# Altium project MSXIV_Rear_Power_Distribution.PrjPcb (part 1 of 5)
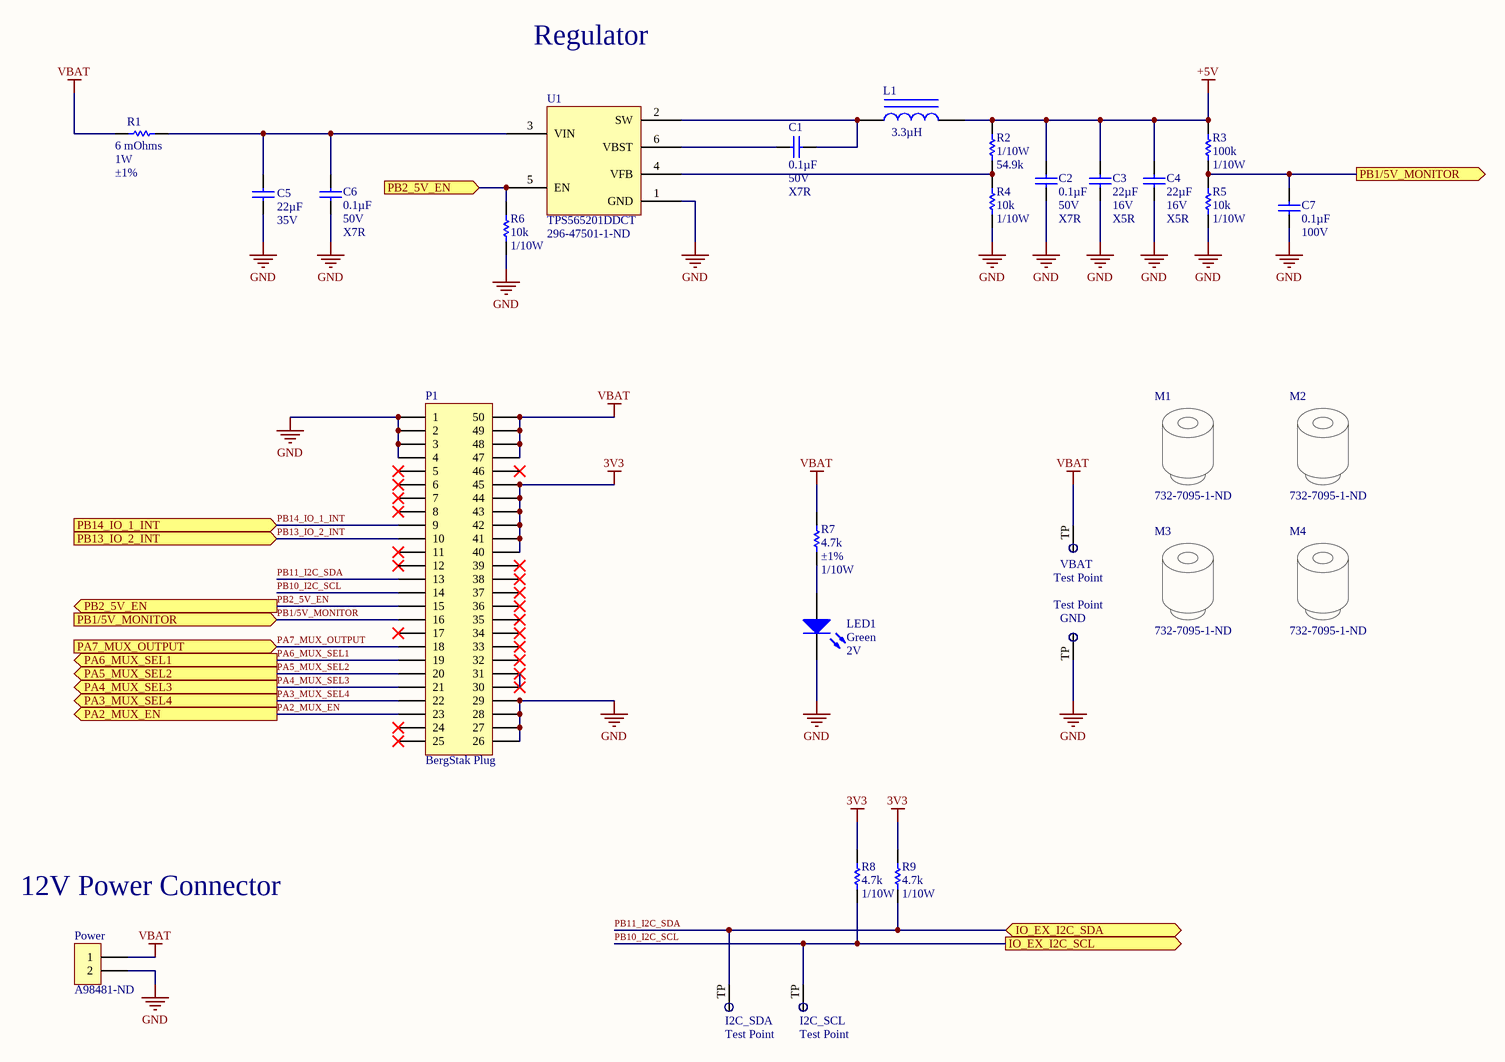
[diagram p0: Controller_Board_Interface.SchDoc]
9 sheets, 277 parts. Net scope: flat (ports and power ports of the same name join across sheets).
Board file: Rear Power Distribution.PcbDoc
Sheets:
  Controller_Board_Interface.SchDoc
  Power Distribution - IO Expander.SchDoc
  Power Distribution - Strobe and Center Brake Lights.SchDoc
  Power Distribution - Spares 8-9 5V.SchDoc
  Power Distribution - Motor Interface.SchDoc
  Power Distribution - Spares 1-4 5V.SchDoc
  Power Distribution - Rear Turn and Brake Lights.SchDoc
  Power Distribution - Solar Sense, Telemetry, and BMS.SchDoc
  Power Distribution -  Rear Camera and Charger.SchDoc

## Sheet Controller_Board_Interface.SchDoc: Controller Board Interface
size B; Organization: Midnight Sun Solar Rayce Car Team; Address1: University of Waterloo; Address2: 200 University Ave W; Address3: Waterloo, ON, Canada; Address4: N2L 3E9; Website: www.uwmidsun.com; ProjectName: ProjectName

### Parts
C1  Capacitance: 0.1µF  Voltage: 50V  Temperature Coefficient: X7R  [CAP, 0603]  (hidden comment: CAP CER 0.1UF 50V 10% X7R 0603)
C2  Capacitance: 0.1µF  Voltage: 50V  Temperature Coefficient: X7R  [CAP, 0603]  (hidden comment: CAP CER 0.1UF 50V 10% X7R 0603)
C3  Capacitance: 22µF  Voltage: 16V  Temperature Coefficient: X5R  [CAP, 1210]  (hidden comment: CAP CER 22UF 16V ±20% X5R 1210)
C4  Capacitance: 22µF  Voltage: 16V  Temperature Coefficient: X5R  [CAP, 1210]  (hidden comment: CAP CER 22UF 16V ±20% X5R 1210)
C5  CAP CER 22UF 35V X5R 0805  [CAP, 0805]  (value not drawn)
C6  Capacitance: 0.1µF  Voltage: 50V  Temperature Coefficient: X7R  [CAP, 0603]  (hidden comment: CAP CER 0.1UF 50V 10% X7R 0603)
C7  Capacitance: 0.1µF  Voltage: 100V  [CAP, 0805]  (hidden comment: CAP CER 0.1UF 100V 10% X7R 0805)
GND  Test Point  [Test Point]  (no BOM)
I2C_SCL  Test Point  [Test Point]  (no BOM)
I2C_SDA  Test Point  [Test Point]  (no BOM)
L1  Inductance: 3.3µH  [IND_1264EY-3R3N=P3]  (hidden comment: FIXED IND 3.3UH 6.5A 25.2 MOHM)
LED1  Color: Green  Voltage - Forward (Vf) (Typ): 2V  [LED_0603]  (hidden comment: LED GREEN CLEAR 2V 0603)
M1  Supplier Part Number 1: 732-7095-1-ND  [M2.5 Standoff]  (hidden comment: STANDOFF RND M2.5X0.45 STEEL 5MM)
M2  Supplier Part Number 1: 732-7095-1-ND  [M2.5 Standoff]  (hidden comment: STANDOFF RND M2.5X0.45 STEEL 5MM)
M3  Supplier Part Number 1: 732-7095-1-ND  [M2.5 Standoff]  (hidden comment: STANDOFF RND M2.5X0.45 STEEL 5MM)
M4  Supplier Part Number 1: 732-7095-1-ND  [M2.5 Standoff]  (hidden comment: STANDOFF RND M2.5X0.45 STEEL 5MM)
P1  Series: BergStak Plug  [CONN, Bergstak 50 Pos Plug]  (hidden comment: CONN 50POS Bergstak Plug 0.02")
Power  Supplier Part Number 1: A98481-ND  [6PCV-02-006]  (hidden comment: CONN BARRIER STRIP 2CIRC 0.375")
R1  Resistance: 6 mOhms  Power (Watts): 1W  Tolerance: ±1%  [RES 1206]  (hidden comment: RES 0.006 OHM 1% 1W 1206)
R2  Power (Watts): 1/10W  Resistance (Ohms): 54.9k  [RES, 0603]  (hidden comment: RES 54.9K OHM 1% 1/10W 0603)
R3  Resistance: 100k  Power: 1/10W  [RES, 0603]  (hidden comment: RES 100K OHM 5% 1/8W 0603)
R4  Resistance: 10k  Power: 1/10W  [RES, 0603]  (hidden comment: RES 10K OHM 1% 1/10W 0603)
R5  Resistance: 10k  Power: 1/10W  [RES, 0603]  (hidden comment: RES 10K OHM 1% 1/10W 0603)
R6  Resistance: 10k  Power: 1/10W  [RES, 0603]  (hidden comment: RES 10K OHM 1% 1/10W 0603)
R7  Resistance (Ohms): 4.7k  Tolerance: ±1%  Power (Watts): 1/10W  [RES, 0603]  (hidden comment: RES 4.7K OHM 1% 1/10W 0603)
R8  Resistance (Ohms): 4.7k  Power (Watts): 1/10W  [RES, 0603]  (hidden comment: RES 4.7K OHM 1% 1/10W 0603)
R9  Resistance (Ohms): 4.7k  Power (Watts): 1/10W  [RES, 0603]  (hidden comment: RES 4.7K OHM 1% 1/10W 0603)
U1  Manufacturer Part Number: TPS565201DDCT  Supplier Part Number 1: 296-47501-1-ND  [IC REG BUCK 4.5V TO 17V, 5A]  (hidden comment: IC REG BUCK 4.5V TO 17V, 5A, SYNCHRONOUS STE)
VBAT  Test Point  [Test Point]  (no BOM)

### Ports
IO_EX_I2C_SCL (out), IO_EX_I2C_SDA (bidir), PA2_MUX_EN (out), PA3_MUX_SEL4 (out), PA4_MUX_SEL3 (out), PA5_MUX_SEL2 (out), PA6_MUX_SEL1 (out), PA7_MUX_OUTPUT (in), PB1/5V_MONITOR (in), PB1/5V_MONITOR (out), PB2_5V_EN (in), PB2_5V_EN (out), PB13_IO_2_INT (in), PB14_IO_1_INT (in)

### Nets
3V3: P1.40 P1.41 P1.42 P1.43 P1.44 P1.45 R8.1 R9.1
+5V: C2.1 C3.1 C4.1 L1.2 R2.1 R3.1
GND: C2.2 C3.2 C4.2 C5.2 C6.2 C7.2 GND.TP LED1.2(K) P1.1 P1.2 P1.3 P1.4 P1.26 P1.27 P1.28 P1.29 Power.2 R4.2 R5.2 R6.2 U1.1(GND)
VBAT: P1.47 P1.48 P1.49 P1.50 Power.1 R1.1 R7.1 VBAT.TP
PA2_MUX_EN: P1.23 ; port PA2_MUX_EN
PA3_MUX_SEL4: P1.22 ; port PA3_MUX_SEL4
PA4_MUX_SEL3: P1.21 ; port PA4_MUX_SEL3
PA5_MUX_SEL2: P1.20 ; port PA5_MUX_SEL2
PA6_MUX_SEL1: P1.19 ; port PA6_MUX_SEL1
PA7_MUX_OUTPUT: P1.18 ; port PA7_MUX_OUTPUT
PB1/5V_MONITOR: C7.1 P1.16 R3.2 R5.1 ; port PB1/5V_MONITOR
PB2_5V_EN: P1.15 R6.1 U1.5(EN) ; port PB2_5V_EN
PB10_I2C_SCL: I2C_SCL.TP P1.14 R8.2 ; port IO_EX_I2C_SCL  [project net IO_EX_I2C_SCL]
PB11_I2C_SDA: I2C_SDA.TP P1.13 R9.2 ; port IO_EX_I2C_SDA  [project net IO_EX_I2C_SDA]
PB13_IO_2_INT: P1.10 ; port PB13_IO_2_INT
PB14_IO_1_INT: P1.9 ; port PB14_IO_1_INT
NetC1_1: C1.1 U1.6(VBST)
NetC1_2: C1.2 L1.1 U1.2(SW)
NetC5_1: C5.1 C6.1 R1.2 U1.3(VIN)
NetLED1_1: LED1.1(A) R7.2
NetP1_30: P1.30 P1.31
NetR2_2: R2.2 R4.1 U1.4(VFB)

Not connected (* = marked no-connect by the designer): P1 5* 6* 7* 8* 11* 12* 17* 24* 25* 32* 33* 34* 35* 36* 37* 38* 39* 46*

### Notes on the sheet
- Regulator
- 12V Power Connector
- PROJECT
- DOCUMENT
- DRAWN BY
- LAST MODIFIED
- PART NUMBER
- REVISION
- SHEET
- VARIANT
- OF
- Engineering 5 - 1002
  University of Waterloo
  (519) 888-4567 x32978
  hardware@uwmidsun.com
- (in symbol CAP CER 22UF 35V X5R 0805) 22µF

### Library data of the parts
C1 C2 C6 = CAP CER 0.1UF 50V 10% X7R 0603: 0.10µF ±10% 50V Ceramic Capacitor X7R 0603 (1608 Metric); Manufacturer 1: AVX Corporation; Manufacturer Part Number 1: 06035C104KAT2A; Supplier 1: Digi-Key; Supplier Part Number 1: 478-5052-1-ND; Packaging: Cut Tape (CT); Part Status: Active; Operating Temperature: -55°C ~ 125°C; Ratings: -; Mounting Type: Surface Mount, MLCC; Package / Case: 0603 (1608 Metric); Size / Dimension: 0.063" L x 0.032" W (1.60mm x 0.81mm); Height - Seated (Max): -; Thickness (Max): 0.035" (0.90mm); Lead Spacing: -; Lead Style: -; ComponentLink1URL: http://datasheets.avx.com/X7RDielectric.pdf; ComponentLink1Description: http://datasheets.avx.com/X7RDielectric.pdf; Tolerance: ±10%
C3 C4 = CAP CER 22UF 16V ±20% X5R 1210: 22µF ±20% 16V Ceramic Capacitor X5R 1210 (3225 Metric); Manufacturer 1: Murata Electronics North America; Manufacturer Part Number 1: GRM32ER61C226ME20L; Supplier 1: Digi-Key; Supplier Part Number 1: 490-1881-1-ND; Packaging: Cut Tape (CT); Part Status: Active; Operating Temperature: -55°C ~ 85°C; Ratings: -; Mounting Type: Surface Mount, MLCC; Package / Case: 1210 (3225 Metric); Size / Dimension: 0.126" L x 0.098" W (3.20mm x 2.50mm); Height - Seated (Max): -; Thickness (Max): 0.106" (2.70mm); Lead Spacing: -; Lead Style: -; ComponentLink1URL: http://www.murata.com/~/media/webrenewal/support/library/catalog/products/capacitor/mlcc/c02e.ashx; ComponentLink1Description: http://www.murata.com/~/media/webrenewal/support/library/catalog/products/capacitor/mlcc/c02e.ashx; Tolerance: ±20%
C5 = CAP CER 22UF 35V X5R 0805: 22µF ±20% 35V Ceramic Capacitor X5R 0805 (2012 Metric); Manufacturer: TDK; Manufacturer Part Number: C2012X5R1V226M125AC; Supplier 1: Digi-Key; RoHS: Yes; Stock 1: 30; Pricing 1: 1 = 1.29000, 10 = 0.98100, 100 = 0.70190, 500 = 0.54338, 1000 = 0.46791 (USD); Mount: Surface Mount; Case/Package: 0805; Weight: 0.000194oz; Case Code (Metric): 2012; Case Code (Imperial): 0805; Dielectric Material: Ceramic; Min Operating Temperature: -55°C; Max Operating Temperature: 85°C; Package Quantity: 2000; Packaging: Tape and Reel; Capacitance: 22uF; Tolerance: 20%; Voltage Rating: 35V; Dielectric: X5R; Termination: SMD/SMT; Voltage Rating (DC): 35V; Length: 0.079inch; Height: 1.25mm; Width: 0.049inch; Thickness: 0.057inch; REACH SVHC: No SVHC; Lead Free: Lead Free; ComponentLink1URL: https://product.tdk.com/info/en/catalog/spec/mlccspec_commercial_general_midvoltage_en.pdf; ComponentLink1Description: https://product.tdk.com/info/en/catalog/spec/mlccspec_commercial_general_midvoltage_en.pdf; Supplier Part Number 1: 445-14428-1-ND
C7 = CAP CER 0.1UF 100V 10% X7R 0805: 0.1µF ±10% 100V Ceramic Capacitor X7R 0805 (2012 Metric); Manufacturer 1: Murata Electronics North America; Manufacturer Part Number 1: GCM21BR72A104KA37L; Supplier 1: Digi-Key; Supplier Part Number 1: 490-4789-1-ND; Packaging: Cut Tape (CT); Part Status: Active; Operating Temperature: -55°C ~ 125°C; Ratings: AEC-Q200; Mounting Type: Surface Mount, MLCC; Package / Case: 0805 (2012 Metric); Size / Dimension: 0.079" L x 0.049" W (2.00mm x 1.25mm); Height - Seated (Max): -; Thickness (Max): 0.055" (1.40mm); Lead Spacing: -; Lead Style: -; ComponentLink1URL: http://www.murata.com/~/media/webrenewal/support/library/catalog/products/capacitor/mlcc/c03e.ashx; ComponentLink1Description: http://www.murata.com/~/media/webrenewal/support/library/catalog/products/capacitor/mlcc/c03e.ashx; Tolerance: ±10%; Temperature Coefficient: X7R
L1 = FIXED IND 3.3UH 6.5A 25.2 MOHM: 3.3µH Shielded Wirewound Inductor 6.5A 25.2mOhm Max Nonstandard; Tolerance: ±30%; Inductance Frequency - Test: 100kHz; Material - Core: Ferrite; Supplier 1: Digi-Key; ComponentLink1Description: https://search.murata.co.jp/Ceramy/image/img/P02/J(E)TE243B-0044_DG6050C_reference.pdf; ComponentLink1URL: https://search.murata.co.jp/Ceramy/image/img/P02/J(E)TE243B-0044_DG6050C_reference.pdf; Type: Wirewound; Current Rating (Amps): 6.5A; Shielding: Shielded; DC Resistance (DCR): 25.2mOhm Max; Supplier Part Number 1: 490-10821-1-ND
LED1 = LED GREEN CLEAR 2V 0603: Green 572nm LED Indication - Discrete 2V 0603 (1608 Metric); Manufacturer: Wurth Electronics Inc.; Manufacturer Part Number: 150060VS75000; Lens Color: Colorless; Millicandela Rating: 40mcd; Lens Style/Size: Rectangle with Flat Top, 1.10mm x 0.70mm; Current - Test: 20mA; Viewing Angle: 140°; Wavelength - Dominant: 570nm; Supplier 1: Digi-Key; Supplier Part Number 1: 732-4980-1-ND; Packaging: Cut Tape (CT); Part Status: Active; Lens Transparency: Clear; Mounting Type: Surface Mount; Wavelength - Peak: 572nm; Package / Case: 0603 (1608 Metric); Supplier Device Package: 0603; Size / Dimension: 1.60mm L x 0.80mm W; Height (Max): 0.80mm; ComponentLink1URL: http://katalog.we-online.de/led/datasheet/150060VS75000.pdf; ComponentLink1Description: http://katalog.we-online.de/led/datasheet/150060VS75000.pdf; Category: Optoelectronics; Features: -; Pricing 1: 1=0.21, 100=0.1617, 500=0.13964 (CAD); RoHS: RoHS Compliant; Stock 1: 9408
M1-M4 = STANDOFF RND M2.5X0.45 STEEL 5MM: Manufacturer: Wurth Electronics; Manufacturer Part Number: 9774050151R; Plating: Tin; Threaded/Unthreaded: Threaded; Outside Diameter: 0.201inch; Supplier 1: Digi-Key; RoHS: Yes; Stock 1: 24846; Pricing 1: 1 = 1.09000, 10 = 1.03000, 50 = 0.91800, 100 = 0.84000 (USD); Material: Steel; Length: 0.252inch; REACH SVHC: Unknown
P1 = CONN 50POS Bergstak Plug 0.02": 50 Position Connector Plug, Outer Shroud Contacts Surface Mount Gold; Manufacturer 1: Amphenol FCI; Manufacturer Part Number 1: 10132797-055100LF; Number of Positions: 50; Mated Stacking Heights: 5mm; Pitch: 0.020" (0.50mm); Supplier 1: Digi-Key; Supplier Part Number 1: 609-5226-1-ND; Packaging: Cut Tape (CT); Part Status: Active; Connector Type: Plug, Outer Shroud Contacts; Number of Rows: 2; Mounting Type: Surface Mount; Contact Finish: Gold; Contact Finish Thickness: 1µin (0.025µm); Height Above Board: 0.169" (4.30mm); ComponentLink1URL: http://portal.fciconnect.com/Comergent//fci/drawing/10132797.pdf; ComponentLink1Description: http://portal.fciconnect.com/Comergent//fci/drawing/10132797.pdf
Power = CONN BARRIER STRIP 2CIRC 0.375": 2 Circuit 0.375" (9.53mm) Barrier Block Connector, Screws; ComponentLink1Description: https://www.te.com/commerce/DocumentDelivery/DDEController?Action=srchrtrv&DocNm=3-1437652-9&DocType=Customer+Drawing&DocLang=English; ComponentLink1URL: https://www.te.com/commerce/DocumentDelivery/DDEController?Action=srchrtrv&DocNm=3-1437652-9&DocType=Customer+Drawing&DocLang=English; Supplier 1: Digi-Key
R1 = RES 0.006 OHM 1% 1W 1206: 6 mOhms ±1% 1W Chip Resistor 1206 (3216 Metric) Automotive AEC-Q200, Current Sense Thick Film; ComponentLink1Description: https://d1d2qsbl8m0m72.cloudfront.net/en/products/databook/datasheet/passive/resistor/chip_resistor/pmr-e.pdf; ComponentLink1URL: https://d1d2qsbl8m0m72.cloudfront.net/en/products/databook/datasheet/passive/resistor/chip_resistor/pmr-e.pdf; Supplier 1: Digi-Key; Composition: Thick Film; Supplier Device Package: 1206; Ratings: AEC-Q200; Operating Temperature: -55°C ~ 155°C; Packaging: Cut Tape (CT); Series: PMR; Supplier Part Number 1: RHM.006ALCT-ND
R2 = RES 54.9K OHM 1% 1/10W 0603: 54.9k Ohm ±1% 0.1W, 1/10W Chip Resistor 0603 (1608 Metric) Automotive AEC-Q200 Thick Film; Manufacturer: Panasonic Electronic Components; Manufacturer Part Number: ERJ-3EKF5492V; Temperature Coefficient: ±100ppm/°C; Supplier 1: Digi-Key; RoHS: RoHS Compliant; Category: Resistors; Stock 1: 74038; Pricing 1: 1=0.16, 10=0.031, 100=0.0127, 1000=0.00567, 2500=0.00492 (CAD); Packaging: Cut Tape (CT); Part Status: Active; Composition: Thick Film; Features: Automotive AEC-Q200; Operating Temperature: -55°C ~ 155°C; Package / Case: 0603 (1608 Metric); Supplier Device Package: 0603; Size / Dimension: 0.063" L x 0.031" W (1.60mm x 0.80mm); Height - Seated (Max): 0.022" (0.55mm); Failure Rate: -; ComponentLink1URL: https://industrial.panasonic.com/cdbs/www-data/pdf/RDA0000/AOA0000C298.pdf; ComponentLink1Description: https://industrial.panasonic.com/cdbs/www-data/pdf/RDA0000/AOA0000C298.pdf; Supplier Part Number 1: P54.9KHCT-ND; Tolerance: ±1%
R3 = RES 100K OHM 5% 1/8W 0603: RES SMD 100K OHM 5% 1/10W 0603; Manufacturer 1: Yageo; Manufacturer Part Number 1: RC0603JR-07100KL; Temperature Coefficient: ±100ppm/°C; Supplier 1: Digi-Key; Supplier Part Number 1: 311-100KGRCT-ND; Packaging: Cut Tape (CT); Part Status: Active; Composition: Thick Film; Operating Temperature: -55°C ~ 155°C; Package / Case: 0603 (1608 Metric); Supplier Device Package: 0603; Size / Dimension: 0.063" L x 0.031" W (1.60mm x 0.80mm); Height - Seated (Max): 0.022" (0.55mm); Failure Rate: -; ComponentLink1URL: http://www.yageo.com/documents/recent/PYu-RC_Group_51_RoHS_L_7.pdf; ComponentLink1Description: http://www.yageo.com/documents/recent/PYu-RC_Group_51_RoHS_L_7.pdf; Tolerance: ±5%
R4-R6 = RES 10K OHM 1% 1/10W 0603: RES SMD 10K OHM 1% 1/10W 0603; Manufacturer 1: Yageo; Manufacturer Part Number 1: RC0603FR-0710KL; Temperature Coefficient: ±100ppm/°C; Supplier 1: Digi-Key; Supplier Part Number 1: 311-10.0KHRCT-ND; Packaging: Cut Tape (CT); Part Status: Active; Composition: Thick Film; Operating Temperature: -55°C ~ 155°C; Package / Case: 0603 (1608 Metric); Supplier Device Package: 0603; Size / Dimension: 0.063" L x 0.031" W (1.60mm x 0.80mm); Height - Seated (Max): 0.022" (0.55mm); Failure Rate: -; ComponentLink1URL: http://www.yageo.com/documents/recent/PYu-RC_Group_51_RoHS_L_7.pdf; ComponentLink1Description: http://www.yageo.com/documents/recent/PYu-RC_Group_51_RoHS_L_7.pdf; Tolerance: ±1%
R7-R9 = RES 4.7K OHM 1% 1/10W 0603: 4.7k Ohm ±1% 0.1W, 1/10W Chip Resistor 0603 (1608 Metric) Moisture Resistant Thick Film; Manufacturer 1: Yageo; Manufacturer Part Number 1: RC0603FR-074K7L; Description 1: RES SMD 4.7K OHM 1% 1/10W 0603; Temperature Coefficient: ±100ppm/°C; Supplier 1: Digi-Key; Supplier Part Number 1: 311-4.70KHRCT-ND; RoHS: RoHS Compliant; Category: Resistors; Stock 1: 3487566; Pricing 1: 1=0.16, 10=0.022, 100=0.0089, 1000=0.00402, 2500=0.00349 (CAD); Packaging: Cut Tape (CT); Part Status: Active; Composition: Thick Film; Features: Moisture Resistant; Operating Temperature: -55°C ~ 155°C; Package / Case: 0603 (1608 Metric); Supplier Device Package: 0603; Size / Dimension: 0.063" L x 0.031" W (1.60mm x 0.80mm); Height - Seated (Max): 0.022" (0.55mm); Failure Rate: -; ComponentLink1URL: http://www.yageo.com/documents/recent/PYu-RC_Group_51_RoHS_L_7.pdf; ComponentLink1Description: http://www.yageo.com/documents/recent/PYu-RC_Group_51_RoHS_L_7.pdf
  R8 R9: Tolerance: ±1%
U1 = IC REG BUCK 4.5V TO 17V, 5A, SYNCHRONOUS STE: Buck Switching Regulator IC Positive Adjustable 0.6V 1 Output 5A SOT-23-6 Thin, TSOT-23-6; Manufacturer: Texas Instruments; Supplier 1: Digi-Key; Stock 1: 2226; Pricing 1: 1 = 2.46000, 10 = 2.21100, 100 = 1.77710 (USD); Min Operating Temperature: -40°C; Max Operating Temperature: 125°C

## Sheet Power Distribution - IO Expander.SchDoc: Title
size B; Organization: Midnight Sun Solar Rayce Car Team; Address1: University of Waterloo; Address2: 200 University Ave W; Address3: Waterloo, ON, Canada; Address4: N2L 3E9; Website: www.uwmidsun.com; ProjectName: ProjectName
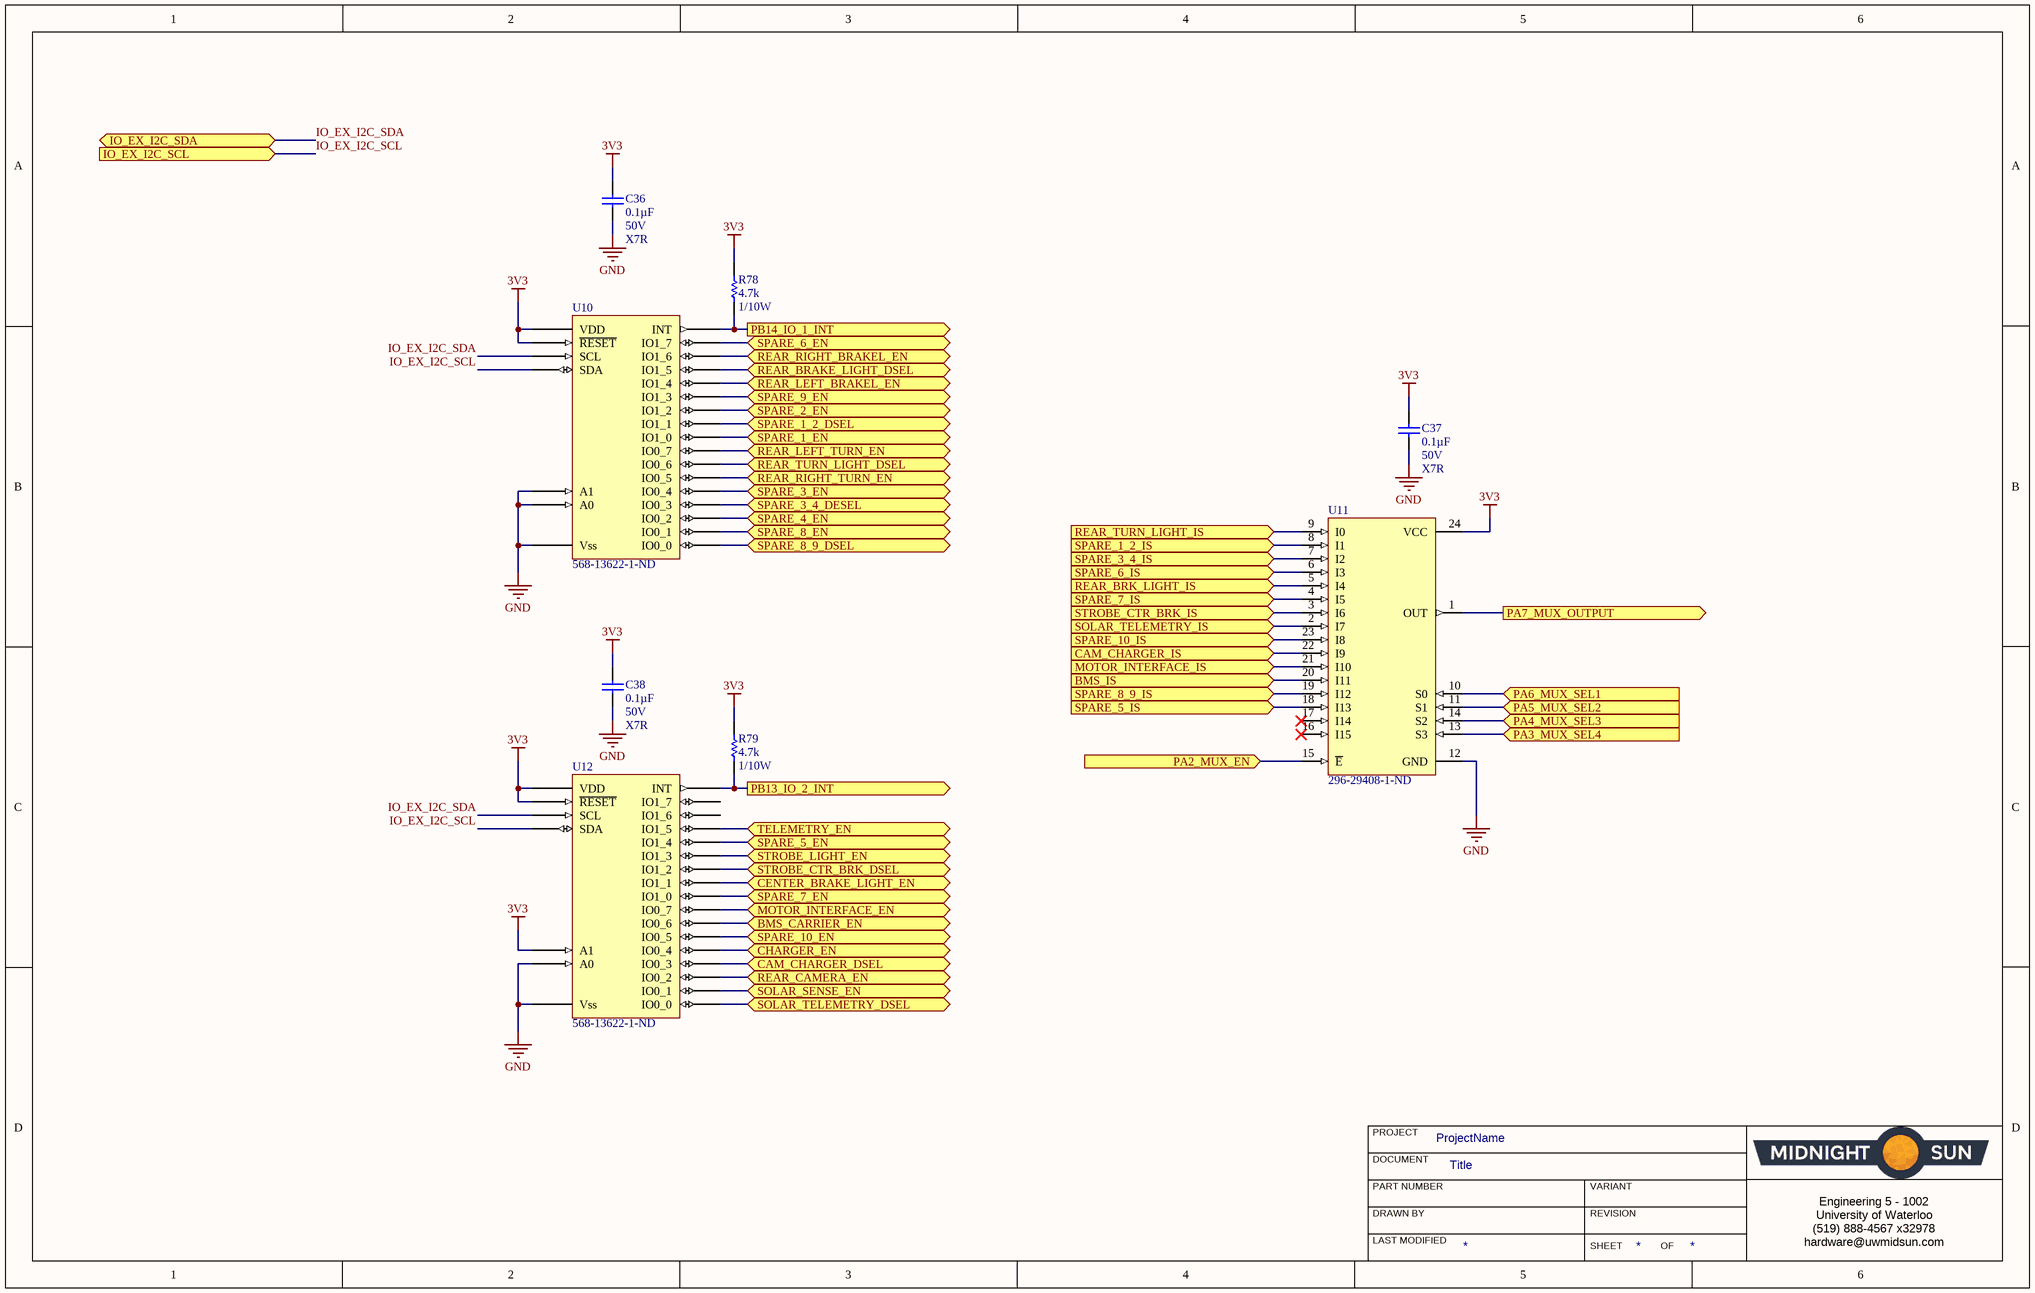
[diagram p1: Power Distribution - IO Expander.SchDoc]

### Parts
C36  Capacitance: 0.1µF  Voltage: 50V  Temperature Coefficient: X7R  [CAP, 0603]  (hidden comment: CAP CER 0.1UF 50V 10% X7R 0603)
C37  Capacitance: 0.1µF  Voltage: 50V  Temperature Coefficient: X7R  [CAP, 0603]  (hidden comment: CAP CER 0.1UF 50V 10% X7R 0603)
C38  Capacitance: 0.1µF  Voltage: 50V  Temperature Coefficient: X7R  [CAP, 0603]  (hidden comment: CAP CER 0.1UF 50V 10% X7R 0603)
R78  Resistance (Ohms): 4.7k  Power (Watts): 1/10W  [RES, 0603]  (hidden comment: RES 4.7K OHM 1% 1/10W 0603)
R79  Resistance (Ohms): 4.7k  Power (Watts): 1/10W  [RES, 0603]  (hidden comment: RES 4.7K OHM 1% 1/10W 0603)
U10  Supplier Part Number 1: 568-13622-1-ND  [SOP127P600-8N]  (hidden comment: 16-BIT I2C-BUS AND SMBUS LOW POW)
U11  Supplier Part Number 1: 296-29408-1-ND  [SOP127P1030X265-24N]  (hidden comment: IC MUX/DEMUX 1X16 24SSOP)
U12  Supplier Part Number 1: 568-13622-1-ND  [SOP127P600-8N]  (hidden comment: 16-BIT I2C-BUS AND SMBUS LOW POW)

### Ports
BMS_CARRIER_EN (bidir), BMS_IS (in), CAM_CHARGER_DSEL (bidir), CAM_CHARGER_IS (in), CENTER_BRAKE_LIGHT_EN (bidir), CHARGER_EN (bidir), IO_EX_I2C_SCL (in), IO_EX_I2C_SDA (bidir), MOTOR_INTERFACE_EN (bidir), MOTOR_INTERFACE_IS (in), PA2_MUX_EN (in), PA3_MUX_SEL4 (in), PA4_MUX_SEL3 (in), PA5_MUX_SEL2 (in), PA6_MUX_SEL1 (in), PA7_MUX_OUTPUT (out), PB13_IO_2_INT (out), PB14_IO_1_INT (out), REAR_BRAKE_LIGHT_DSEL (bidir), REAR_BRK_LIGHT_IS (in), REAR_CAMERA_EN (bidir), REAR_LEFT_BRAKEL_EN (bidir), REAR_LEFT_TURN_EN (bidir), REAR_RIGHT_BRAKEL_EN (bidir), REAR_RIGHT_TURN_EN (bidir), REAR_TURN_LIGHT_DSEL (bidir), REAR_TURN_LIGHT_IS (in), SOLAR_SENSE_EN (bidir), SOLAR_TELEMETRY_DSEL (bidir), SOLAR_TELEMETRY_IS (in), SPARE_1_2_DSEL (bidir), SPARE_1_2_IS (in), SPARE_1_EN (bidir), SPARE_2_EN (bidir), SPARE_3_4_DESEL (bidir), SPARE_3_4_IS (in), SPARE_3_EN (bidir), SPARE_4_EN (bidir), SPARE_5_EN (bidir), SPARE_5_IS (in), SPARE_6_EN (bidir), SPARE_6_IS (in), SPARE_7_EN (bidir), SPARE_7_IS (in), SPARE_8_9_DSEL (bidir), SPARE_8_9_IS (in), SPARE_8_EN (bidir), SPARE_9_EN (bidir), SPARE_10_EN (bidir), SPARE_10_IS (in), STROBE_CTR_BRK_DSEL (bidir), STROBE_CTR_BRK_IS (in), STROBE_LIGHT_EN (bidir), TELEMETRY_EN (bidir)

### Nets
3V3: C36.1 C37.1 C38.1 R78.1 R79.1 U10.3(~{RESET}) U10.24(VDD) U11.24(VCC) U12.2(A1) U12.3(~{RESET}) U12.24(VDD)
GND: C36.2 C37.2 C38.2 U10.2(A1) U10.12(Vss) U10.21(A0) U11.12(GND) U12.12(Vss) U12.21(A0)
IO_EX_I2C_SCL: U10.23(SDA) U12.23(SDA) ; port IO_EX_I2C_SCL
IO_EX_I2C_SDA: U10.22(SCL) U12.22(SCL) ; port IO_EX_I2C_SDA
PA2_MUX_EN: U11.15(~{E}) ; port PA2_MUX_EN
PA3_MUX_SEL4: U11.13(S3) ; port PA3_MUX_SEL4
PA4_MUX_SEL3: U11.14(S2) ; port PA4_MUX_SEL3
PA5_MUX_SEL2: U11.11(S1) ; port PA5_MUX_SEL2
PA6_MUX_SEL1: U11.10(S0) ; port PA6_MUX_SEL1
PA7_MUX_OUTPUT: U11.1(OUT) ; port PA7_MUX_OUTPUT
PB13_IO_2_INT: R79.2 U12.1(INT) ; port PB13_IO_2_INT
PB14_IO_1_INT: R78.2 U10.1(INT) ; port PB14_IO_1_INT
NetC9_1: U11.22(I9) ; port CAM_CHARGER_IS
NetC14_1: U11.23(I8) ; port SPARE_10_IS
NetC19_1: U11.6(I3) ; port SPARE_6_IS
NetC22_1: U11.3(I6) ; port STROBE_CTR_BRK_IS
NetC24_1: U11.4(I5) ; port SPARE_7_IS
NetC30_1: U11.18(I13) ; port SPARE_5_IS
NetC31_1: U11.9(I0) ; port REAR_TURN_LIGHT_IS
NetC35_1: U11.5(I4) ; port REAR_BRK_LIGHT_IS
NetC42_1: U11.8(I1) ; port SPARE_1_2_IS
NetC46_1: U11.7(I2) ; port SPARE_3_4_IS
NetC51_1: U11.20(I11) ; port BMS_IS
NetC53_1: U11.2(I7) ; port SOLAR_TELEMETRY_IS
NetC57_1: U11.19(I12) ; port SPARE_8_9_IS
NetC60_1: U11.21(I10) ; port MOTOR_INTERFACE_IS
NetR10_1: U12.8(IO0_4) ; port CHARGER_EN
NetR10_3: U12.7(IO0_3) ; port CAM_CHARGER_DSEL
NetR10_4: U12.6(IO0_2) ; port REAR_CAMERA_EN
NetR19_1: U12.9(IO0_5) ; port SPARE_10_EN
NetR29_1: U10.20(IO1_7) ; port SPARE_6_EN
NetR30_1: U12.14(IO1_1) ; port CENTER_BRAKE_LIGHT_EN
NetR30_3: U12.15(IO1_2) ; port STROBE_CTR_BRK_DSEL
NetR30_4: U12.16(IO1_3) ; port STROBE_LIGHT_EN
NetR46_1: U12.13(IO1_0) ; port SPARE_7_EN
NetR55_1: U10.11(IO0_7) ; port REAR_LEFT_TURN_EN
NetR55_3: U10.10(IO0_6) ; port REAR_TURN_LIGHT_DSEL
NetR55_4: U10.9(IO0_5) ; port REAR_RIGHT_TURN_EN
NetR57_1: U12.17(IO1_4) ; port SPARE_5_EN
NetR69_1: U10.17(IO1_4) ; port REAR_LEFT_BRAKEL_EN
NetR69_3: U10.18(IO1_5) ; port REAR_BRAKE_LIGHT_DSEL
NetR69_4: U10.19(IO1_6) ; port REAR_RIGHT_BRAKEL_EN
NetR80_1: U10.13(IO1_0) ; port SPARE_1_EN
NetR80_3: U10.14(IO1_1) ; port SPARE_1_2_DSEL
NetR80_4: U10.15(IO1_2) ; port SPARE_2_EN
NetR89_1: U10.8(IO0_4) ; port SPARE_3_EN
NetR89_3: U10.7(IO0_3) ; port SPARE_3_4_DESEL
NetR89_4: U10.6(IO0_2) ; port SPARE_4_EN
NetR102_1: U12.5(IO0_1) ; port SOLAR_SENSE_EN
NetR102_3: U12.4(IO0_0) ; port SOLAR_TELEMETRY_DSEL
NetR102_4: U12.18(IO1_5) ; port TELEMETRY_EN
NetR103_1: U12.10(IO0_6) ; port BMS_CARRIER_EN
NetR115_1: U10.5(IO0_1) ; port SPARE_8_EN
NetR115_3: U10.4(IO0_0) ; port SPARE_8_9_DSEL
NetR115_4: U10.16(IO1_3) ; port SPARE_9_EN
NetR127_1: U12.11(IO0_7) ; port MOTOR_INTERFACE_EN

Not connected (* = marked no-connect by the designer): U11 16(I15)* 17(I14)*; U12 19(IO1_6) 20(IO1_7)

### Notes on the sheet
- PROJECT
- DOCUMENT
- DRAWN BY
- LAST MODIFIED
- PART NUMBER
- REVISION
- SHEET
- VARIANT
- OF
- Engineering 5 - 1002
  University of Waterloo
  (519) 888-4567 x32978
  hardware@uwmidsun.com

### Library data of the parts
C36-C38 = CAP CER 0.1UF 50V 10% X7R 0603: as C1 on sheet Controller_Board_Interface; Supplier 1: Digi-Key; Supplier Part Number 1: 478-5052-1-ND; Packaging: Cut Tape (CT); Part Status: Active; Operating Temperature: -55°C ~ 125°C; Ratings: -; Mounting Type: Surface Mount, MLCC; Package / Case: 0603 (1608 Metric); Size / Dimension: 0.063" L x 0.032" W (1.60mm x 0.81mm); Height - Seated (Max): -; Thickness (Max): 0.035" (0.90mm); Lead Spacing: -; Lead Style: -; ComponentLink1URL: http://datasheets.avx.com/X7RDielectric.pdf; ComponentLink1Description: http://datasheets.avx.com/X7RDielectric.pdf; Tolerance: ±10%
R78 R79 = RES 4.7K OHM 1% 1/10W 0603: as R7 on sheet Controller_Board_Interface; Supplier 1: Digi-Key; Supplier Part Number 1: 311-4.70KHRCT-ND; RoHS: RoHS Compliant; Category: Resistors; Stock 1: 3487566; Pricing 1: 1=0.16, 10=0.022, 100=0.0089, 1000=0.00402, 2500=0.00349 (CAD); Packaging: Cut Tape (CT); Part Status: Active; Composition: Thick Film; Features: Moisture Resistant; Operating Temperature: -55°C ~ 155°C; Package / Case: 0603 (1608 Metric); Supplier Device Package: 0603; Size / Dimension: 0.063" L x 0.031" W (1.60mm x 0.80mm); Height - Seated (Max): 0.022" (0.55mm); Failure Rate: -; ComponentLink1URL: http://www.yageo.com/documents/recent/PYu-RC_Group_51_RoHS_L_7.pdf; ComponentLink1Description: http://www.yageo.com/documents/recent/PYu-RC_Group_51_RoHS_L_7.pdf; Tolerance: ±1%
U10 U12 = 16-BIT I2C-BUS AND SMBUS LOW POW: I/O Expander 16 I²C, SMBus 400kHz 24-TSSOP; ComponentLink1Description: https://www.nxp.com/docs/en/data-sheet/PCA9539_PCA9539R.pdf; ComponentLink1URL: https://www.nxp.com/docs/en/data-sheet/PCA9539_PCA9539R.pdf; Supplier 1: Digi-Key
U11 = IC MUX/DEMUX 1X16 24SSOP: 1 Circuit IC Switch 16:1 160 Ohm 24-SOIC; Manufacturer: Texas Instruments; Manufacturer Part Number: CD74HC4067M96; Number of Channels: 1; Number of Inputs: 16; Max Supply Voltage: 6V; Min Supply Voltage: 2V; Bandwidth: 89MHz; Propagation Delay: 75ns; On-State Resistance: 180R; Turn-On Delay Time: 300ns; Turn-Off Delay Time: 290ns; Logic Function: Demultiplexer,Multiplexer; Operating Supply Current: 8uA; Supply Type: Single; Low Level Output Current: 25mA; ComponentLink1URL: http://www.ti.com/lit/ds/symlink/cd74hc4067.pdf; ComponentLink1Description: http://www.ti.com/lit/ds/symlink/cd74hc4067.pdf; Supplier 1: Digi-Key; Stock 1: 10305; Pricing 1: 1 = 0.80000, 10 = 0.70400, 100 = 0.53940, 500 = 0.42642, 1000 = 0.34114 (USD); RoHS: Yes; Mount: Surface Mount; Case/Package: SOIC; Number of Pins: 24; Weight: 0.022025oz; Contact Plating: Matte,Tin; Min Operating Temperature: -55°C; Max Operating Temperature: 125°C; Number of Outputs: 1; Packaging: Tape and Reel; Package Quantity: 2000; Number of Circuits: 1; Nominal Supply Current: 8uA; Number of Bits: 16; High Level Output Current: 25mA; Length: 15.4mm; Height: 2.35mm; Width: 7.52mm; Radiation Hardening: No; REACH SVHC: No SVHC; Lead Free: Lead Free; ComponentLink2URL: https://www.verical.com/server-webapp/html/getDatasheet?partID=322813&src-supplier=Verical; ComponentLink2Description: https://www.verical.com/server-webapp/html/getDatasheet?partID=322813&src-supplier=Verical; ComponentLink3URL: http://focus.ti.com/lit/ds/symlink/cd74hc4067.pdf?src-supplier=Avnet+Europe; ComponentLink3Description: http://focus.ti.com/lit/ds/symlink/cd74hc4067.pdf?src-supplier=Avnet+Europe; ComponentLink4URL: http://www.ti.com/lit/ds/symlink/cd74hc4067.pdf?src-supplier=Digi-Key; ComponentLink4Description: http://www.ti.com/lit/ds/symlink/cd74hc4067.pdf?src-supplier=Digi-Key